# Altium schematic sheet USBc to Ethernet(2.0).SchDoc (part 2 of 3)
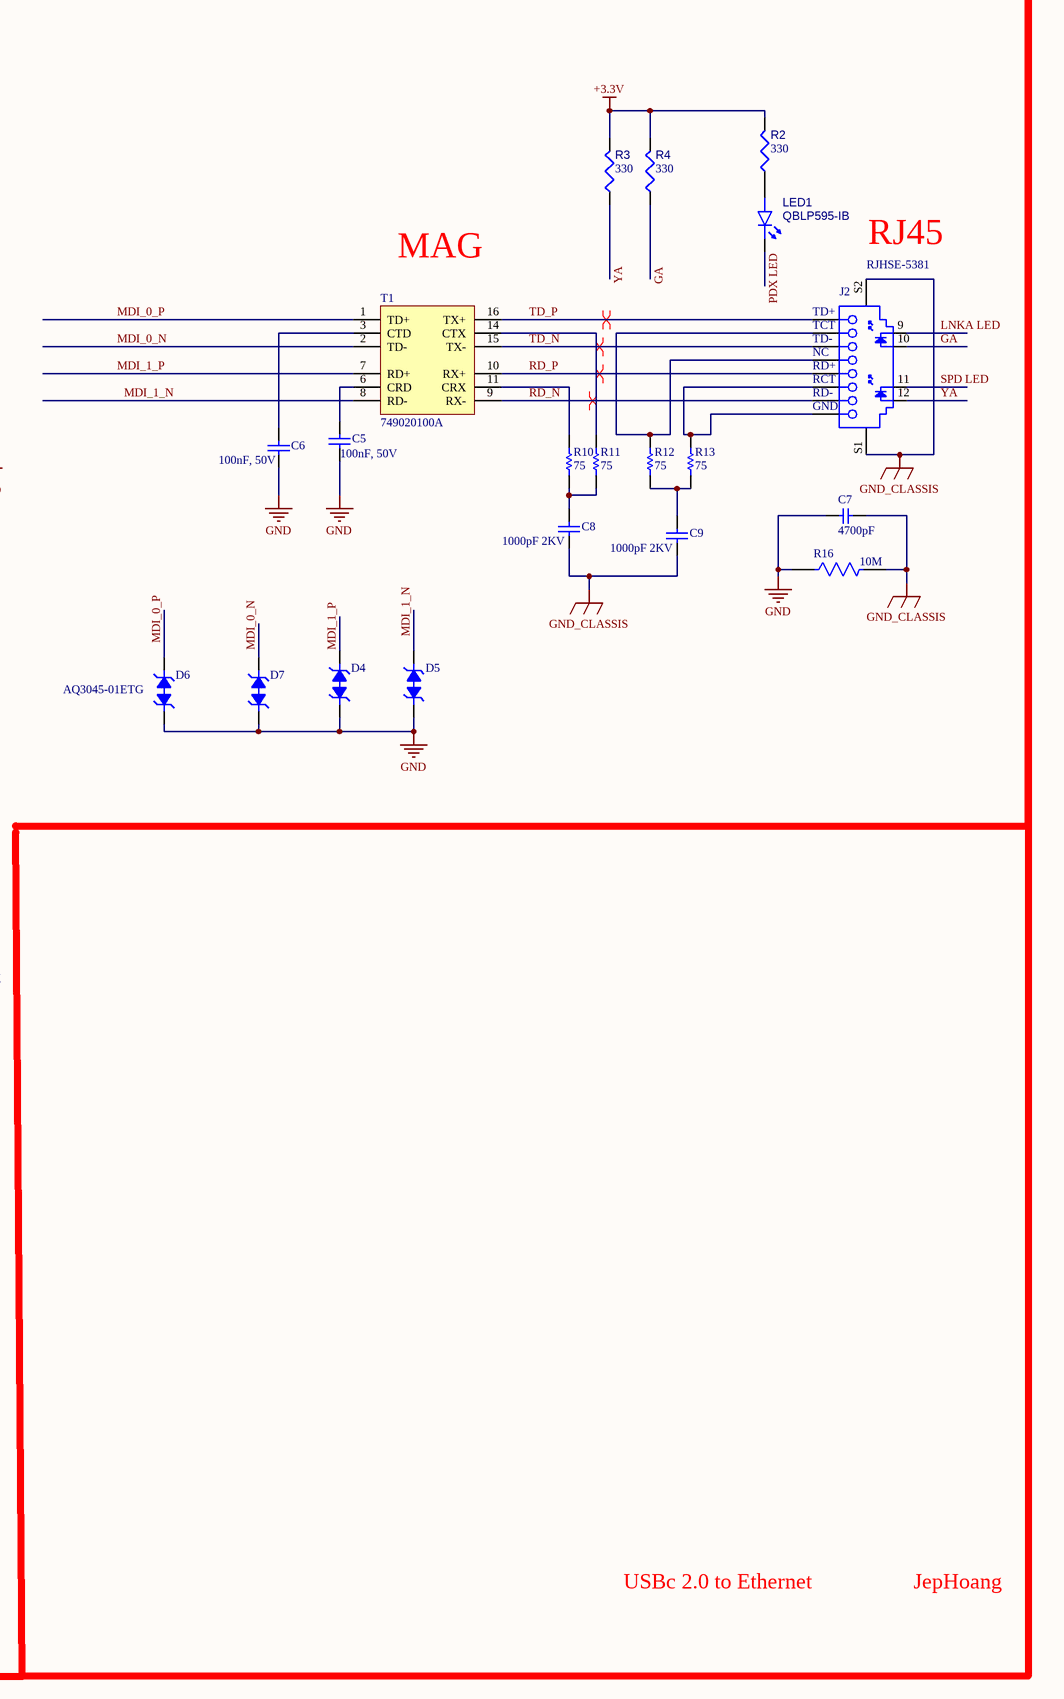
[diagram p2: USBc to Ethernet(2.0).SchDoc, right]
## Library data of the parts
C1 C5 C6 C13-C15 C26 C29 C31 = CL05B104KB54PNC: CAP CER 0.1UF 50V X7R 0402; Manufacturer: Samsung; Dielectric Material: Ceramic; Supplier: Digikey; Supplier Part Number: 1276-CL05B104KB54PNCCT-ND; Manufacturer Part Number: CL05B104KB54PNC; RoHS: Yes; Category: Ceramic Capacitors; Stock: 1237875; Pricing: 1=0.1, 10=0.044, 50=0.025, 100=0.0194, 500=0.0146, 1000=0.01147, 2500=0.01043, 5000=0.00959 (USD); Pins: 2; Capacitor Type: Ceramic; RoHS Compliant: Yes; Reach SVHC Compliant: Yes; ComponentLink1URL: https://datasheet.ciiva.com:443/pdfs/VipMasterIC/IC/SEMS/SEMS-S-A0006318249/SEMS-S-A0006320959-1.pdf?src-supplier=IHS+Markit; ComponentLink1Description: https://datasheet.ciiva.com:443/pdfs/VipMasterIC/IC/SEMS/SEMS-S-A0006318249/SEMS-S-A0006320959-1.pdf?src-supplier=IHS+Markit; ComponentLink2URL: https://datasheet.octopart.com/CL05B104KB54PNC-Samsung-datasheet-8326407.pdf?src-supplier=TME; ComponentLink2Description: https://datasheet.octopart.com/CL05B104KB54PNC-Samsung-datasheet-8326407.pdf?src-supplier=TME; LCSC Part Number: C307331
C2 C3 = CL05C150JC51PNC: Multilayer Ceramic Capacitors MLCC - SMD/SMT 0402 C0G 15pF 5% 100V automotive grade; Manufacturer: Samsung Electro-Mechanics; Temperature Coefficient: 30ppm/°C; Supplier 1: DigiKey; Manufacturer Part Number: CL05C150JC51PNC; RoHS: Compliant; Category: Ceramic Capacitors; Stock 1: 123361; Pricing 1: 1=0.1, 10=0.055, 50=0.0378, 100=0.0326, 500=0.02386 (USD); Capacitance: 15pF; Case/Package: 0402; China RoHS: Compliant; Dielectric Material: Ceramic; Height: 500µm; Length: 1mm; Lifecycle Status: Production; Material: Ceramic; Max Operating Temperature: 125°C; Min Operating Temperature: -55°C; Mount: Surface Mount; Number of Terminals: 2; REACH SVHC: Unaffected; Tolerance: 5%; Voltage Rating: 100V; Voltage Rating (DC): 100V; Width: 500µm; ComponentLink1URL: https://datasheet.octopart.com:443/CL05C150JC51PNC-Samsung-Electro-Mechanics-datasheet-176142735.pdf?src-supplier=IHS; ComponentLink1Description: https://datasheet.octopart.com:443/CL05C150JC51PNC-Samsung-Electro-Mechanics-datasheet-176142735.pdf?src-supplier=IHS
C4 C7 C16 C27 C32 C34 C36 C39 = CL05B472KB5NNNC: 4700 pF ±10% 50V Ceramic Capacitor X7R 0402 (1005 Metric); Manufacturer: Samsung Electro-Mechanics; Capacitance: 4.7nF; Supplier 1: DigiKey; Manufacturer Part Number: CL05B472KB5NNNC; RoHS: Compliant; Category: Ceramic Capacitors; Stock 1: 84266; Pricing 1: 1=0.1, 10=0.033, 50=0.0224, 100=0.019, 500=0.01354 (USD); Case/Package: 0402; Case Code (Imperial): 0402; Case Code (Metric): 1005; China RoHS: Compliant; Country of Origin: Mainland China, Philippines, South Korea; Depth: 500µm; Dielectric: X7R; Dielectric Material: Ceramic; Export Control Classification Number (ECCN) Code: EAR99; Height: 550µm; Harmonized Tariff Schedule (HTS) Code: 8532.24.00.20; Introduction Date: 2010-02-10; Lead Free: Lead Free; Length: 1mm; Lifecycle Status: Production; Material: Ceramic; Max Operating Temperature: 125°C; Min Operating Temperature: -55°C; Mount: Surface Mount; Number of Terminals: 2; Radiation Hardening: No; REACH SVHC: Unaffected; Schedule B: 8532240020, 8532240020|8532240020, 8532240020|8532240020|8532240020, 8532240020|8532240020|8532240020|8532240020; Thickness: 558.8µm; Tolerance: 10%; Voltage: 50V; Voltage Rating: 50V; Voltage Rating (DC): 50V; Width: 500µm; ComponentLink1URL: https://datasheet.octopart.com:443/CL05B472KB5NNNC-Samsung-Electro-Mechanics-datasheet-182018856.pdf?src-supplier=IHS; ComponentLink1Description: https://datasheet.octopart.com:443/CL05B472KB5NNNC-Samsung-Electro-Mechanics-datasheet-182018856.pdf?src-supplier=IHS; ComponentLink2URL: https://datasheet.octopart.com:443/CL05B472KB5NNNC-Samsung-Electro-Mechanics-datasheet-137699841.pdf?src-supplier=Samsung+SCT; ComponentLink2Description: https://datasheet.octopart.com:443/CL05B472KB5NNNC-Samsung-Electro-Mechanics-datasheet-137699841.pdf?src-supplier=Samsung+SCT; ComponentLink3URL: https://datasheet.octopart.com:443/CL05B472KB5NNNC-Samsung-Electro-Mechanics-datasheet-116890943.pdf?src-supplier=Future+Electronics; ComponentLink3Description: https://datasheet.octopart.com:443/CL05B472KB5NNNC-Samsung-Electro-Mechanics-datasheet-116890943.pdf?src-supplier=Future+Electronics; ComponentLink4URL: https://datasheet.octopart.com:443/CL05B472KB5NNNC-Samsung-Electro-Mechanics-datasheet-81461654.pdf?src-supplier=Future+Electronics; ComponentLink4Description: https://datasheet.octopart.com:443/CL05B472KB5NNNC-Samsung-Electro-Mechanics-datasheet-81461654.pdf?src-supplier=Future+Electronics; ComponentLink5URL: https://datasheet.octopart.com:443/CL05B472KB5NNNC-Samsung-datasheet-42485177.pdf?src-supplier=Future+Electronics; ComponentLink5Description: https://datasheet.octopart.com:443/CL05B472KB5NNNC-Samsung-datasheet-42485177.pdf?src-supplier=Future+Electronics; ComponentLink6URL: https://datasheet.octopart.com:443/CL05B472KB5NNNC-Samsung-datasheet-26589051.pdf?src-supplier=Future+Electronics; ComponentLink6Description: https://datasheet.octopart.com:443/CL05B472KB5NNNC-Samsung-datasheet-26589051.pdf?src-supplier=Future+Electronics; ComponentLink7URL: https://datasheet.octopart.com:443/CL05B472KB5NNNC-Samsung-datasheet-12537298.pdf?src-supplier=Future+Electronics; ComponentLink7Description: https://datasheet.octopart.com:443/CL05B472KB5NNNC-Samsung-datasheet-12537298.pdf?src-supplier=Future+Electronics; ComponentLink8URL: https://datasheet.octopart.com:443/CL05B472KB5NNNC-Samsung-Electro-Mechanics-datasheet-149154072.pdf?src-supplier=Future+Electronics; ComponentLink8Description: https://datasheet.octopart.com:443/CL05B472KB5NNNC-Samsung-Electro-Mechanics-datasheet-149154072.pdf?src-supplier=Future+Electronics; ComponentLink9URL: https://datasheet.octopart.com/CL05B472KB5NNNC-Samsung-Electro-Mechanics-datasheet-97040617.pdf; ComponentLink9Description: https://datasheet.octopart.com/CL05B472KB5NNNC-Samsung-Electro-Mechanics-datasheet-97040617.pdf; ComponentLink10URL: https://datasheet.octopart.com/CL05B472KB5NNNC-Samsung-Electro-Mechanics-datasheet-8324245.pdf; ComponentLink10Description: https://datasheet.octopart.com/CL05B472KB5NNNC-Samsung-Electro-Mechanics-datasheet-8324245.pdf; ComponentLink11URL: https://datasheet.octopart.com:443/CL05B472KB5NNNC-Samsung-Electro-Mechanics-datasheet-11772878.pdf?src-supplier=Arrow+Electronics; ComponentLink11Description: https://datasheet.octopart.com:443/CL05B472KB5NNNC-Samsung-Electro-Mechanics-datasheet-11772878.pdf?src-supplier=Arrow+Electronics; ComponentLink12URL: https://datasheet.octopart.com:443/CL05B472KB5NNNC-Samsung-datasheet-8326407.pdf?src-supplier=TME; ComponentLink12Description: https://datasheet.octopart.com:443/CL05B472KB5NNNC-Samsung-datasheet-8326407.pdf?src-supplier=TME
C8 C9 = CMP-2000-05161-1: Chip Capacitor, 1 nF, +/- 10%, 2000 V, -55 to 125 degC, 1206 (3216 Metric), RoHS, Tape and Reel; Manufacturer: Johanson Dielectrics; Brand: JohansonDielectrics; Case Length: 3.15mm; Type: HighVoltageCapacitors; Dielectric: X7R; Case Width: 1.6mm; Class: 2; Case Height: 1.27mm; Case Code - mm: 3216; Package / Case: 1206(3216metric); Case Code - in: 1206; Voltage Rating DC: 2kV; Manufacturer URL: http://www.johansondielectrics.com; Tolerance: 10%; Minimum Operating Temperature: -55C; Termination Style: SMD/SMT; Datasheet Version: Apr-07; RoHS: Details; Factory Pack Quantity: 3000; Datasheet URL: http://www.farnell.com/datasheets/87135.pdf; Capacitance: 1000pF; Product Category: MultilayerCeramicCapacitorsMLCC-SMD/SMT; Maximum Operating Temperature: +125C; Product: GeneralTypeMLCCs; Packaging: Reel
C10 C11 = CL05A106MP5NUNC: CAP CER 10UF 10V X5R 0402; Manufacturer: Samsung Electro-Mechanics; Capacitance: 10µF; Dielectric Material: Ceramic; Tolerance: 20%; Supplier 1: DigiKey; Manufacturer Part Number: CL05A106MP5NUNC; RoHS: Compliant; Category: Ceramic Capacitors; Stock 1: 4; Pricing 1: 1=0.18, 10=0.104, 50=0.0732, 100=0.0638, 500=0.0481 (USD); Case/Package: 0402; Case Code (Imperial): 0402; Case Code (Metric): 1005; China RoHS: Compliant; Contact Plating: Tin; Depth: 500µm; Dielectric: X5R; Height: 700µm; Lead Free: Lead Free; Length: 1mm; Lifecycle Status: NRND; Material: Ceramic; Max Operating Temperature: 85°C; Min Operating Temperature: -55°C; Mount: Surface Mount; Number of Terminals: 2; Packaging: Tape and Reel; Radiation Hardening: No; REACH SVHC: Unaffected; Schedule B: 8532240020, 8532240020|8532240020|8532240020|8532240020|8532240020|8532240020|8532240020|8532240020|8532240020|8532240020|8532240020|8532240020|8532240020|8532240020|8532240020|8532240020|8532240020|8532240020|8532240020|8532240020|8532240020|8532240020|8532240020|85; Termination: Wraparound; Thickness: 711.2µm; Voltage Rating: 10V; Voltage Rating (DC): 10V; Width: 500µm; ComponentLink1URL: https://datasheet.octopart.com:443/CL05A106MP5NUNC-Samsung-Electro-Mechanics-datasheet-182018593.pdf?src-supplier=IHS; ComponentLink1Description: https://datasheet.octopart.com:443/CL05A106MP5NUNC-Samsung-Electro-Mechanics-datasheet-182018593.pdf?src-supplier=IHS; ComponentLink2URL: https://datasheet.octopart.com:443/CL05A106MP5NUNC-Samsung-Electro-Mechanics-datasheet-136031723.pdf?src-supplier=Upverter; ComponentLink2Description: https://datasheet.octopart.com:443/CL05A106MP5NUNC-Samsung-Electro-Mechanics-datasheet-136031723.pdf?src-supplier=Upverter; ComponentLink3URL: https://datasheet.octopart.com:443/CL05A106MP5NUNC-Samsung-Electro-Mechanics-datasheet-110226206.pdf?src-supplier=Future+Electronics; ComponentLink3Description: https://datasheet.octopart.com:443/CL05A106MP5NUNC-Samsung-Electro-Mechanics-datasheet-110226206.pdf?src-supplier=Future+Electronics; ComponentLink4URL: https://datasheet.octopart.com:443/CL05A106MP5NUNC-Samsung-Electro-Mechanics-datasheet-87580039.pdf?src-supplier=Future+Electronics; ComponentLink4Description: https://datasheet.octopart.com:443/CL05A106MP5NUNC-Samsung-Electro-Mechanics-datasheet-87580039.pdf?src-supplier=Future+Electronics; ComponentLink5URL: https://datasheet.octopart.com:443/CL05A106MP5NUNC-Samsung-Electro-Mechanics-datasheet-81461595.pdf?src-supplier=Future+Electronics; ComponentLink5Description: https://datasheet.octopart.com:443/CL05A106MP5NUNC-Samsung-Electro-Mechanics-datasheet-81461595.pdf?src-supplier=Future+Electronics; ComponentLink6URL: https://datasheet.octopart.com:443/CL05A106MP5NUNC-Samsung-datasheet-42280527.pdf?src-supplier=Future+Electronics; ComponentLink6Description: https://datasheet.octopart.com:443/CL05A106MP5NUNC-Samsung-datasheet-42280527.pdf?src-supplier=Future+Electronics; ComponentLink7URL: https://datasheet.octopart.com:443/CL05A106MP5NUNC-Samsung-datasheet-34153002.pdf?src-supplier=Future+Electronics; ComponentLink7Description: https://datasheet.octopart.com:443/CL05A106MP5NUNC-Samsung-datasheet-34153002.pdf?src-supplier=Future+Electronics; ComponentLink8URL: https://datasheet.octopart.com:443/CL05A106MP5NUNC-Samsung-datasheet-25077983.pdf?src-supplier=Future+Electronics; ComponentLink8Description: https://datasheet.octopart.com:443/CL05A106MP5NUNC-Samsung-datasheet-25077983.pdf?src-supplier=Future+Electronics; ComponentLink9URL: https://datasheet.octopart.com:443/CL05A106MP5NUNC-Samsung-Electro-Mechanics-datasheet-149136670.pdf?src-supplier=Future+Electronics; ComponentLink9Description: https://datasheet.octopart.com:443/CL05A106MP5NUNC-Samsung-Electro-Mechanics-datasheet-149136670.pdf?src-supplier=Future+Electronics; ComponentLink10URL: https://datasheet.octopart.com:443/CL05A106MP5NUNC-Samsung-datasheet-8326407.pdf?src-supplier=TME; ComponentLink10Description: https://datasheet.octopart.com:443/CL05A106MP5NUNC-Samsung-datasheet-8326407.pdf?src-supplier=TME
C12 = CL05A475MO5NUNC: CAP CER 4.7UF 16V X5R 0402; Manufacturer: Samsung Electro-Mechanics; Capacitance: 4.7µF; Dielectric Material: Ceramic; Tolerance: 20%; Supplier 1: DigiKey; Manufacturer Part Number: CL05A475MO5NUNC; RoHS: Compliant; Category: Ceramic Capacitors; Stock 1: 764058; Pricing 1: 1=0.52, 10=0.316, 50=0.2358, 100=0.211, 500=0.16936 (USD); Case/Package: 0402; Case Code (Imperial): 0402; Case Code (Metric): 1005; China RoHS: Compliant; Dielectric: X5R; Height: 500µm; Length: 1mm; Lifecycle Status: Production; Material: Ceramic; Max Operating Temperature: 85°C; Min Operating Temperature: -55°C; Mount: Surface Mount; Number of Terminals: 2; REACH SVHC: Unaffected; Schedule B: 8532240020, 8532240020|8532240020, 8532240020|8532240020|8532240020, 8532240020|8532240020|8532240020|8532240020; Thickness: 558.8µm; Voltage Rating: 16V; Voltage Rating (DC): 16V; Width: 500µm; ComponentLink1URL: https://datasheet.octopart.com:443/CL05A475MO5NUNC-Samsung-Electro-Mechanics-datasheet-178175196.pdf?src-supplier=Farnell; ComponentLink1Description: https://datasheet.octopart.com:443/CL05A475MO5NUNC-Samsung-Electro-Mechanics-datasheet-178175196.pdf?src-supplier=Farnell; ComponentLink2URL: https://datasheet.octopart.com:443/CL05A475MO5NUNC-Samsung-Electro-Mechanics-datasheet-123102911.pdf?src-supplier=Future+Electronics; ComponentLink2Description: https://datasheet.octopart.com:443/CL05A475MO5NUNC-Samsung-Electro-Mechanics-datasheet-123102911.pdf?src-supplier=Future+Electronics; ComponentLink3URL: https://datasheet.octopart.com:443/CL05A475MO5NUNC-Samsung-Electro-Mechanics-datasheet-110226225.pdf?src-supplier=Future+Electronics; ComponentLink3Description: https://datasheet.octopart.com:443/CL05A475MO5NUNC-Samsung-Electro-Mechanics-datasheet-110226225.pdf?src-supplier=Future+Electronics; ComponentLink4URL: https://datasheet.octopart.com:443/CL05A475MO5NUNC-Samsung-Electro-Mechanics-datasheet-83567908.pdf?src-supplier=Future+Electronics; ComponentLink4Description: https://datasheet.octopart.com:443/CL05A475MO5NUNC-Samsung-Electro-Mechanics-datasheet-83567908.pdf?src-supplier=Future+Electronics; ComponentLink5URL: https://datasheet.octopart.com:443/CL05A475MO5NUNC-Samsung-Electro-Mechanics-datasheet-68297032.pdf?src-supplier=Future+Electronics; ComponentLink5Description: https://datasheet.octopart.com:443/CL05A475MO5NUNC-Samsung-Electro-Mechanics-datasheet-68297032.pdf?src-supplier=Future+Electronics; ComponentLink6URL: https://datasheet.octopart.com:443/CL05A475MO5NUNC-Samsung-Electro-Mechanics-datasheet-87580057.pdf?src-supplier=Future+Electronics; ComponentLink6Description: https://datasheet.octopart.com:443/CL05A475MO5NUNC-Samsung-Electro-Mechanics-datasheet-87580057.pdf?src-supplier=Future+Electronics; ComponentLink7URL: https://datasheet.octopart.com:443/CL05A475MO5NUNC-Samsung-Electro-Mechanics-datasheet-149136694.pdf?src-supplier=Future+Electronics; ComponentLink7Description: https://datasheet.octopart.com:443/CL05A475MO5NUNC-Samsung-Electro-Mechanics-datasheet-149136694.pdf?src-supplier=Future+Electronics
C17 C28 C33 = CL05B152KB5VPNC: 1500 pF ±10% 50V Ceramic Capacitor X7R 0402 (1005 Metric); Manufacturer: Samsung Electro-Mechanics; Capacitance: 1.5nF; Supplier 1: DigiKey; Manufacturer Part Number: CL05B152KB5VPNC; RoHS: Compliant; Category: Ceramic Capacitors; Stock 1: 275794; Pricing 1: 1=0.1, 10=0.036, 50=0.0242, 100=0.0206, 500=0.01472 (USD); Case/Package: 0402; Case Code (Imperial): 0402; Case Code (Metric): 1005; China RoHS: Compliant; Dielectric Material: Ceramic; Features: Soft Termination; Height: 550µm; Lead Free: Lead Free; Length: 990.6µm; Lifecycle Status: Production; Material: Ceramic; Max Operating Temperature: 125°C; Min Operating Temperature: -55°C; Mount: Surface Mount; Number of Terminals: 2; Packaging: Tape & Reel (TR); Ratings: AEC-Q200; REACH SVHC: Unaffected; Thickness: 558.8µm; Tolerance: 10%; Voltage Rating: 50V; Voltage Rating (DC): 50V; Width: 508µm; ComponentLink1URL: https://datasheet.octopart.com:443/CL05B152KB5VPNC-Samsung-Electro-Mechanics-datasheet-176142735.pdf?src-supplier=IHS; ComponentLink1Description: https://datasheet.octopart.com:443/CL05B152KB5VPNC-Samsung-Electro-Mechanics-datasheet-176142735.pdf?src-supplier=IHS; ComponentLink2URL: https://datasheet.octopart.com:443/CL05B152KB5VPNC-Samsung-Electro-Mechanics-datasheet-141346877.pdf?src-supplier=Samsung+SCT; ComponentLink2Description: https://datasheet.octopart.com:443/CL05B152KB5VPNC-Samsung-Electro-Mechanics-datasheet-141346877.pdf?src-supplier=Samsung+SCT; ComponentLink3URL: https://datasheet.octopart.com:443/CL05B152KB5VPNC-Samsung-datasheet-66660282.pdf?src-supplier=Future+Electronics; ComponentLink3Description: https://datasheet.octopart.com:443/CL05B152KB5VPNC-Samsung-datasheet-66660282.pdf?src-supplier=Future+Electronics; ComponentLink4URL: https://datasheet.octopart.com:443/CL05B152KB5VPNC-Samsung-datasheet-62043905.pdf?src-supplier=Future+Electronics; ComponentLink4Description: https://datasheet.octopart.com:443/CL05B152KB5VPNC-Samsung-datasheet-62043905.pdf?src-supplier=Future+Electronics; ComponentLink5URL: https://datasheet.octopart.com:443/CL05B152KB5VPNC-Samsung-Electro-Mechanics-datasheet-68304628.pdf?src-supplier=Future+Electronics; ComponentLink5Description: https://datasheet.octopart.com:443/CL05B152KB5VPNC-Samsung-Electro-Mechanics-datasheet-68304628.pdf?src-supplier=Future+Electronics; ComponentLink6URL: https://datasheet.octopart.com:443/CL05B152KB5VPNC-Samsung-Electro-Mechanics-datasheet-149136721.pdf?src-supplier=Future+Electronics; ComponentLink6Description: https://datasheet.octopart.com:443/CL05B152KB5VPNC-Samsung-Electro-Mechanics-datasheet-149136721.pdf?src-supplier=Future+Electronics; ComponentLink7URL: https://datasheet.octopart.com:443/CL05B152KB5VPNC-Samsung-datasheet-8326407.pdf?src-supplier=TME; ComponentLink7Description: https://datasheet.octopart.com:443/CL05B152KB5VPNC-Samsung-datasheet-8326407.pdf?src-supplier=TME
C18 C19 C22 C24 C35 = CL05B104KB5NNNC: Multilayer Ceramic Capacitors MLCC - SMD/SMT 100nF0.150V X7R 1005 0402; Manufacturer: Samsung Electro-Mechanics; Tolerance: 10%; Supplier 1: DigiKey; Manufacturer Part Number: CL05B104KB5NNNC; RoHS: Compliant; Category: Ceramic Capacitors; Stock 1: 1658214; Pricing 1: 1=0.11, 10=0.056, 50=0.0386, 100=0.0332, 500=0.0242 (USD); Capacitance: 100nF; Case/Package: 0402; China RoHS: Compliant; Country of Origin: Mainland China, Philippines, South Korea; Dielectric: X7R; Dielectric Material: Ceramic; Export Control Classification Number (ECCN) Code: EAR99; Height: 550µm; Harmonized Tariff Schedule (HTS) Code: 8532.24.00.20; Introduction Date: 2017-07-04; Lifecycle Status: Production; Material: Ceramic; Max Operating Temperature: 125°C; Min Operating Temperature: -55°C; Mount: Surface Mount; Number of Terminals: 2; REACH SVHC: Unaffected; Voltage Rating: 50V; Voltage Rating (DC): 50V; ComponentLink1URL: https://datasheet.octopart.com:443/CL05B104KB5NNNC-Samsung-Electro-Mechanics-datasheet-141346860.pdf?src-supplier=IHS; ComponentLink1Description: https://datasheet.octopart.com:443/CL05B104KB5NNNC-Samsung-Electro-Mechanics-datasheet-141346860.pdf?src-supplier=IHS; ComponentLink2URL: https://datasheet.octopart.com/CL05B104KB5NNNC-Samsung-Electro-Mechanics-datasheet-97040617.pdf; ComponentLink2Description: https://datasheet.octopart.com/CL05B104KB5NNNC-Samsung-Electro-Mechanics-datasheet-97040617.pdf; ComponentLink3URL: https://datasheet.octopart.com/General-Multilayer-Ceramic-Capacitors-Samsung-datasheet-family-111.pdf; ComponentLink3Description: https://datasheet.octopart.com/General-Multilayer-Ceramic-Capacitors-Samsung-datasheet-family-111.pdf; ComponentLink4URL: https://datasheet.octopart.com:443/CL05B104KB5NNNC-Samsung-datasheet-8326407.pdf?src-supplier=TME; ComponentLink4Description: https://datasheet.octopart.com:443/CL05B104KB5NNNC-Samsung-datasheet-8326407.pdf?src-supplier=TME; ComponentLink5URL: http://sigma.octopart.com:80/rohs_certificate/General-Multilayer-Ceramic-Capacitors-Samsung-family-110.pdf?src-supplier=Compliance+Statements; ComponentLink5Description: http://sigma.octopart.com:80/rohs_certificate/General-Multilayer-Ceramic-Capacitors-Samsung-family-110.pdf?src-supplier=Compliance+Statements; ComponentLink6URL: http://sigma.octopart.com:80/rohs_statement/General-Multilayer-Ceramic-Capacitors-Samsung-family-132.pdf?src-supplier=Compliance+Statements; ComponentLink6Description: http://sigma.octopart.com:80/rohs_statement/General-Multilayer-Ceramic-Capacitors-Samsung-family-132.pdf?src-supplier=Compliance+Statements; ComponentLink7URL: http://sigma.octopart.com:80/reach_statement/General-Multilayer-Ceramic-Capacitors-Samsung-family-133.pdf?src-supplier=Compliance+Statements; ComponentLink7Description: http://sigma.octopart.com:80/reach_statement/General-Multilayer-Ceramic-Capacitors-Samsung-family-133.pdf?src-supplier=Compliance+Statements; Mouser Part Number: 187-CL05B104KB5NNNC
C20 C21 C23 C25 = CMP-001-00069-3: Chip Capacitor, 10nF +/-20%, 50V, 0402, Thickness 0.6 mm; Tolerance: 5%; Max Operating Temperature: 85°C; Pins: 2; Case/Package: 0402; Voltage Rating: 50V; Min Operating Temperature: -55°C; Mounting Technology: SMT
C30 = CMP-001-00063-3: Chip Capacitor, 1µF +/-20%, 10V, 0402, Thickness 0.6 mm; Tolerance: 10%; Mounting Technology: SMT; Max Operating Temperature: 85°C; Voltage Rating: 10V; Pins: 2; Case/Package: 0402; Min Operating Temperature: -55°C
C37 C38 = CMP-001-00072-4: Chip Capacitor, 12pF +/-10%, 50V, 0402, Thickness 0.33 mm; Tolerance: 20%; Pins: 2; Max Operating Temperature: 85°C; Case/Package: 0402; Voltage Rating: 50V; Mounting Technology: SMT; Min Operating Temperature: -55°C
D1-D7 = AQ3045-01ETG: TVS DIODE 5.3VWM 12VC SOD882; Manufacturer: Littelfuse; Diode Element Material: SILICON; Package Body Material: Plastic; Polarity: Bidirectional; Max Breakdown Voltage: 9V; Min Breakdown Voltage: 6.8V; Diode Type: TRANS VOLTAGE SUPPRESSOR; Non-rep Peak Rev Power Dis-Max: 40W; Number of Elements: 1; Rep Pk Reverse Voltage-Max: 5.3V; Reference Standard: AEC-Q101; Supplier: Digikey; Supplier Part Number: F9321CT-ND; Manufacturer Part Number: AQ3045-01ETG; RoHS: Yes; Category: TVS Diodes; Stock: 21664; Pricing: 1=0.5, 10=0.391, 100=0.2344, 500=0.217, 1000=0.14756, 2000=0.13585, 5000=0.1302 (USD); Pins: 2; Package Shape: Rectangular; Min Operating Temperature: -55°C; Max Operating Temperature: 150°C; Package Style: CHIP CARRIERMeter; Surface Mount: Yes; Technology: AVALANCHE; Terminal Form: No Lead; Terminal Position: BOTTOM; Reach SVHC Compliant: Yes; RoHS Compliant: Yes; ComponentLink1URL: https://datasheet.ciiva.com:443/pdfs/VipMasterIC/IC/LFSI/LFSI-S-A0007892042/LFSI-S-A0007892042-1.pdf?src-supplier=IHS+Markit; ComponentLink1Description: https://datasheet.ciiva.com:443/pdfs/VipMasterIC/IC/LFSI/LFSI-S-A0007892042/LFSI-S-A0007892042-1.pdf?src-supplier=IHS+Markit; ComponentLink2URL: https://www.littelfuse.com/~/media/electronics/datasheets/tvs_diode_arrays/littelfuse_tvs_diode_array_aq3045_datasheet.pdf.pdf?src-supplier=Digikey; ComponentLink2Description: https://www.littelfuse.com/~/media/electronics/datasheets/tvs_diode_arrays/littelfuse_tvs_diode_array_aq3045_datasheet.pdf.pdf?src-supplier=Digikey; ComponentLink3URL: http://www.littelfuse.com/~/media/electronics/datasheets/tvs_diode_arrays/littelfuse_tvs_diode_array_aq3045_datasheet.pdf.pdf?src-supplier=Digikey; ComponentLink3Description: http://www.littelfuse.com/~/media/electronics/datasheets/tvs_diode_arrays/littelfuse_tvs_diode_array_aq3045_datasheet.pdf.pdf?src-supplier=Digikey; LCSC Part Number: C3710326
FB1-FB3 = MMZ1608B121CTAH0: FERRITE BEAD 120 OHM 0603 1LN; Manufacturer: TDK; Manufacturer Lifecycle Status: PRODUCTION; Current Rating: 600mA; DC Resistance (DCR): 150mΩ; Impedance: 120Ω; Number of Circuits: 1; Test Frequency: 100MHz; Tolerance: 25%; Supplier 1: DigiKey; Manufacturer Part Number: MMZ1608B121CTAH0; RoHS: Compliant; Category: Ferrite Beads and Chips; Stock 1: 284237; Pricing 1: 1=0.1, 10=0.053, 25=0.046, 50=0.0414, 100=0.0372, 250=0.03208, 500=0.02858, 1000=0.02535 (USD); Case/Package: 0603; Case Code (Imperial): 0603; Case Code (Metric): 1608; Core Material: Ferrite; Depth: 800µm; Export Control Classification Number (ECCN) Code: EAR99; Height: 600µm; Harmonized Tariff Schedule (HTS) Code: 8504.50.80.00; Introduction Date: 2009-03-27; Length: 1.6mm; Lifecycle Status: Production; Max DC Current: 600mA; Max Length: 1.75mm; Max Operating Temperature: 125°C; Max Width: 950µm; Min Length: 1.45mm; Min Operating Temperature: -55°C; Min Width: 650µm; Mount: Surface Mount; Number of Terminals: 2; REACH SVHC: Unaffected; Resistance: 150mΩ; RMS Current (Irms): 600mA; Schedule B: 8504500000, 8504500000|8504500000|8504500000|8504500000|8504500000; Series Resistance: 150mΩ; Width: 800µm; ComponentLink1URL: https://datasheet.octopart.com:443/MMZ1608B121CTAH0-TDK-datasheet-151651381.pdf?src-supplier=ODG+(Origin+Data+Global); ComponentLink1Description: https://datasheet.octopart.com:443/MMZ1608B121CTAH0-TDK-datasheet-151651381.pdf?src-supplier=ODG+(Origin+Data+Global); ComponentLink2URL: https://datasheet.octopart.com:443/MMZ1608B121CTAH0-TDK-datasheet-41213274.pdf?src-supplier=Upverter; ComponentLink2Description: https://datasheet.octopart.com:443/MMZ1608B121CTAH0-TDK-datasheet-41213274.pdf?src-supplier=Upverter; ComponentLink3URL: https://datasheet.octopart.com:443/MMZ1608B121CTAH0-TDK-datasheet-82475256.pdf?src-supplier=Newark; ComponentLink3Description: https://datasheet.octopart.com:443/MMZ1608B121CTAH0-TDK-datasheet-82475256.pdf?src-supplier=Newark; ComponentLink4URL: https://datasheet.octopart.com:443/MMZ1608B121CTAH0-TDK-datasheet-101614771.pdf?src-supplier=Newark; ComponentLink4Description: https://datasheet.octopart.com:443/MMZ1608B121CTAH0-TDK-datasheet-101614771.pdf?src-supplier=Newark; ComponentLink5URL: https://datasheet.octopart.com:443/MMZ1608B121CTAH0-TDK-datasheet-17595614.pdf?src-supplier=TME; ComponentLink5Description: https://datasheet.octopart.com:443/MMZ1608B121CTAH0-TDK-datasheet-17595614.pdf?src-supplier=TME
J1 = 217179-0001: USB-C (USB TYPE-C) USB 2.0 Receptacle Connector 24 (16+8 Dummy) Position Surface Mount, Right Angle; Through Hole; Manufacturer: Molex; Manufacturer Lifecycle Status: ACTIVE; Contact Resistance: 50mΩ; Current Rating: 1.25A; Dielectric Material: Polyamide; Gender: Female; Insulation Resistance: 100MΩ; Number of Contacts: 16; Number of Ports: 1; USB Standard: USB 2.0; Voltage Rating: 30V; Supplier 1: DigiKey; Manufacturer Part Number: 217179-0001; RoHS: Compliant; Category: USB Connectors; Stock 1: 93695; Pricing 1: 1=0.9, 10=0.764, 25=0.7156, 50=0.6814, 100=0.6487, 250=0.60808, 500=0.57902 (USD); China RoHS: Compliant; Contact Material: Gold, Nickel; Country of Origin: Mainland China; Export Control Classification Number (ECCN) Code: EAR99; Height: 3.36mm; Harmonized Tariff Schedule (HTS) Code: 8536.69.40.30; Insulation Color: Black; Introduction Date: 2021-08-30; Lifecycle Status: Production; Max Operating Temperature: 85°C; Min Operating Temperature: -40°C; Number of Positions: 16; Number of Rows: 1; Orientation: Right Angle; REACH SVHC: Unaffected; Shell Finish: Nickel; Shell Material: Stainless Steel; Terminal Pitch: 500µm; ComponentLink1URL: https://datasheet.octopart.com:443/217179-0001-Molex-datasheet-158871109.pdf?src-supplier=ODG+(Origin+Data+Global); ComponentLink1Description: https://datasheet.octopart.com:443/217179-0001-Molex-datasheet-158871109.pdf?src-supplier=ODG+(Origin+Data+Global); ComponentLink2URL: https://sigma.octopart.com:443/158871110/technical_drawing/Molex-217179-0001.pdf?src-supplier=Upverter; ComponentLink2Description: https://sigma.octopart.com:443/158871110/technical_drawing/Molex-217179-0001.pdf?src-supplier=Upverter; ComponentLink3URL: https://datasheet.octopart.com:443/217179-0001-Molex-datasheet-164573281.pdf?src-supplier=RS+(Formerly+Allied+Electronics); ComponentLink3Description: https://datasheet.octopart.com:443/217179-0001-Molex-datasheet-164573281.pdf?src-supplier=RS+(Formerly+Allied+Electronics); ComponentLink4URL: http://sigma.octopart.com:80/reach_statement/Molex-company-74.pdf?src-supplier=Compliance+Statements; ComponentLink4Description: http://sigma.octopart.com:80/reach_statement/Molex-company-74.pdf?src-supplier=Compliance+Statements; ComponentLink5URL: http://sigma.octopart.com:80/rohs_statement/Molex-company-73.pdf?src-supplier=Compliance+Statements; ComponentLink5Description: http://sigma.octopart.com:80/rohs_statement/Molex-company-73.pdf?src-supplier=Compliance+Statements; ComponentLink6URL: http://sigma.octopart.com:80/conflict_mineral_statement/Molex-company-72.pdf?src-supplier=Compliance+Statements; ComponentLink6Description: http://sigma.octopart.com:80/conflict_mineral_statement/Molex-company-72.pdf?src-supplier=Compliance+Statements
J2 = CMP-2000-06980-1: High Speed RJ45, Modular Jack, 8 Position, 8 Contacts, Shielded, with LEDs, -55 to 85 degC,12-Pin THD, RoHS, Tray; Manufacturer: Amphenol; Number of Positions/Contacts: 8p8c(RJ45,Ethernet); Number of Ports: 1; Catalog Drawings: RJ45SeriesRightAngle; PCN Design/Specification: MultipleSeriesCopper29/Jan/2009RJHSEShieldMaterial30/Jun/2015; Other Names: RJHSE5381; Online Catalog: RJHSESeries; Featured Product: ModularJacksProductSolutions; Tab Direction: Up; Shielding: Shielded,EMIFinger; LED Color: Yellow-Green; 3D Model: RJHSE538x.stpRJHSE538x.igs; Category: Connectors,Interconnects; Termination: Solder; Housing Material: Thermoplastic; Mounting Type: ThroughHole; Family: ModularConnectors-Jacks; Orientation: 90°Angle(Right); Features: BoardLock; Contact Material: PhosphorBronze; Mounting Technology: ThroughHole; Number of Rows: 1; Standard Package: 120; Ratings: -; Operating Temperature: -55°C~85°C; Series: RJHSE; Contact Finish: Gold; Package Reference: RJHSE-5381; Ingress Protection: -; Package Description: 12-Pin Through Hole Device, Body 16.51 x 15.75 mm; Contact Finish Thickness: 50µin(1.27µm); Datasheet URL: https://datasheet.ciiva.com/16481/rjhse538x-16481714.pdf; Datasheet Version: Rev. K, 04/2014; Connector Type: Jack; Manufacturer URL: http://www.amphenol.com/; Packaging: Tray
LED1 = CMP-007-00042-3: Chip LED 0402, Blue, 0.02 A, 3.1 to 3.7 V, -40 to 80 degC, 2-Pin SMD, RoHS, Tape and Reel; RoHS Compliant: Yes; Colour: Blue; Pins: 2; Case/Package: 0402; Mounting Technology: SMT
R1 R5 = AF0402FR-075K1L: 5.1 kOhms ±1% 0.063W, 1/16W Chip Resistor 0402 (1005 Metric) Anti-Sulfur, Automotive AEC-Q200 Thick Film; Manufacturer: Yageo Group; Max Power Dissipation: 63mW; Power Rating: 62.5mW; Resistance: 5.1kΩ; Temperature Coefficient: 100ppm/°C; Voltage Rating: 50V; Supplier 1: DigiKey; Manufacturer Part Number: AF0402FR-075K1L; RoHS: Compliant; Category: Chip SMD Resistors; Stock 1: 1902; Pricing 1: 1=0.1, 10=0.041, 25=0.0312, 50=0.0256, 100=0.0212, 250=0.01684, 500=0.01436, 1000=0.01241, 5000=0.00931 (USD); Case/Package: 0402; China RoHS: Non-Compliant; Composition: Thick Film; Features: Anti-Sulfur, Moisture Resistant; Height: 350µm; Lead Free: Lead Free; Length: 1mm; Lifecycle Status: Production; Max Operating Temperature: 155°C; Min Operating Temperature: -55°C; Mount: Surface Mount; Number of Terminals: 2; Number of Terminations: 2; Ratings: AEC-Q200; REACH SVHC: Unaffected; Tolerance: 1%; Width: 500µm; Working Voltage: 50V; ComponentLink1URL: https://datasheet.octopart.com:443/AF0402FR-075K1L-Yageo-datasheet-182189395.pdf?src-supplier=IHS; ComponentLink1Description: https://datasheet.octopart.com:443/AF0402FR-075K1L-Yageo-datasheet-182189395.pdf?src-supplier=IHS; ComponentLink2URL: https://datasheet.octopart.com:443/AF0402FR-075K1L-Yageo-datasheet-153645569.pdf?src-supplier=Upverter; ComponentLink2Description: https://datasheet.octopart.com:443/AF0402FR-075K1L-Yageo-datasheet-153645569.pdf?src-supplier=Upverter; ComponentLink3URL: https://sigma.octopart.com:443/138820526/technical_drawing/Yageo-AF0402FR-075K1L.pdf?src-supplier=Upverter; ComponentLink3Description: https://sigma.octopart.com:443/138820526/technical_drawing/Yageo-AF0402FR-075K1L.pdf?src-supplier=Upverter; ComponentLink4URL: https://datasheet.octopart.com:443/AF0402FR-075K1L-Yageo-Group-datasheet-183876366.pdf?src-supplier=LCSC; ComponentLink4Description: https://datasheet.octopart.com:443/AF0402FR-075K1L-Yageo-Group-datasheet-183876366.pdf?src-supplier=LCSC; ComponentLink5URL: https://datasheet.octopart.com:443/AF0402FR-075K1L-Yageo-datasheet-164730775.pdf?src-supplier=Future+Electronics; ComponentLink5Description: https://datasheet.octopart.com:443/AF0402FR-075K1L-Yageo-datasheet-164730775.pdf?src-supplier=Future+Electronics; ComponentLink6URL: https://datasheet.octopart.com:443/AF0402FR-075K1L-Yageo-datasheet-137481464.pdf?src-supplier=Future+Electronics; ComponentLink6Description: https://datasheet.octopart.com:443/AF0402FR-075K1L-Yageo-datasheet-137481464.pdf?src-supplier=Future+Electronics; ComponentLink7URL: https://datasheet.octopart.com:443/AF0402FR-075K1L-Yageo-datasheet-65873192.pdf?src-supplier=Future+Electronics; ComponentLink7Description: https://datasheet.octopart.com:443/AF0402FR-075K1L-Yageo-datasheet-65873192.pdf?src-supplier=Future+Electronics; ComponentLink8URL: https://datasheet.octopart.com:443/AF0402FR-075K1L-Yageo-datasheet-39119213.pdf?src-supplier=Future+Electronics; ComponentLink8Description: https://datasheet.octopart.com:443/AF0402FR-075K1L-Yageo-datasheet-39119213.pdf?src-supplier=Future+Electronics; ComponentLink9URL: https://datasheet.octopart.com:443/AF0402FR-075K1L-Yageo-datasheet-34148693.pdf?src-supplier=Future+Electronics; ComponentLink9Description: https://datasheet.octopart.com:443/AF0402FR-075K1L-Yageo-datasheet-34148693.pdf?src-supplier=Future+Electronics; ComponentLink10URL: https://datasheet.octopart.com:443/AF0402FR-075K1L-Yageo-datasheet-27714391.pdf?src-supplier=Future+Electronics; ComponentLink10Description: https://datasheet.octopart.com:443/AF0402FR-075K1L-Yageo-datasheet-27714391.pdf?src-supplier=Future+Electronics; ComponentLink11URL: https://datasheet.octopart.com:443/AF0402FR-075K1L-Yageo-datasheet-20945081.pdf?src-supplier=Future+Electronics; ComponentLink11Description: https://datasheet.octopart.com:443/AF0402FR-075K1L-Yageo-datasheet-20945081.pdf?src-supplier=Future+Electronics; ComponentLink12URL: https://datasheet.octopart.com/AF0402FR-075K1L-Yageo-datasheet-68296209.pdf; ComponentLink12Description: https://datasheet.octopart.com/AF0402FR-075K1L-Yageo-datasheet-68296209.pdf; ComponentLink13URL: http://sigma.octopart.com:80/conflict_mineral_statement/Yageo-company-3.pdf?src-supplier=Compliance+Statements; ComponentLink13Description: http://sigma.octopart.com:80/conflict_mineral_statement/Yageo-company-3.pdf?src-supplier=Compliance+Statements; ComponentLink14URL: http://sigma.octopart.com:80/rohs_statement/Yageo-company-2.pdf?src-supplier=Compliance+Statements; ComponentLink14Description: http://sigma.octopart.com:80/rohs_statement/Yageo-company-2.pdf?src-supplier=Compliance+Statements
R2-R4 = CMP-009-00132-3: Chip Resistor, 330 Ohms, +/-5 %, 63 mW, -55 to 155 degC, 0402; Power: 63mW; Tolerance: 5%; Pins: 2; Max Operating Temperature: 155°C; Min Operating Temperature: -55°C; Case/Package: 0402
R6 = RC0402JR-070RL: RES 0 OHM JUMPER 1/16W 0402; Manufacturer: Yageo; Power: 62.5mW; Rated Temperature: 70°C; Package Height: 0.35mm; Package Length: 1mm; Package Width: 0.5mm; Supplier: Digikey; Supplier Part Number: 311-0.0JRCT-ND; Manufacturer Part Number: RC0402JR-070RL; RoHS: Yes; Category: Chip SMD Resistors; Stock: 5988729; Pricing: 1=0.1, 10=0.011, 25=0.0084, 50=0.0064, 100=0.0045, 250=0.00364, 500=0.0029, 1000=0.00214, 5000=0.00154 (USD); Mounting Technology: Surface Mount; Pins: 2; Package Shape: Rectangular; Case/Package: 0402; Terminal Finish: Nickel; Min Operating Temperature: -55°C; Max Operating Temperature: 155°C; JESD-609 Code: e3; Resistor Type: FIXED RESISTOR; Construction: Chip; Package Style: SMTMeter; Packaging: Tape and Reel; Value: 0R; Technology: METAL GLAZE/THICK FILM; Termination: Wraparound; Reach SVHC Compliant: Yes; RoHS Compliant: Yes; ComponentLink1URL: https://datasheet.ciiva.com:443/pdfs/VipMasterIC/IC/YAGO/YAGO-S-A0008145938/YAGO-S-A0008145938-1.pdf?src-supplier=IHS+Markit; ComponentLink1Description: https://datasheet.ciiva.com:443/pdfs/VipMasterIC/IC/YAGO/YAGO-S-A0008145938/YAGO-S-A0008145938-1.pdf?src-supplier=IHS+Markit; LCSC Part Number: C60485
R7 = RT0402FRE07500RL: 500 Ohms 1% 0.063W, 1/16W Chip Resistor 0402 (1005 Metric) Moisture Resistant; Manufacturer: Yageo Group; Power Rating: 63mW; Resistance: 500Ω; Temperature Coefficient: 50ppm/°C; Voltage Rating: 50V; Supplier 1: DigiKey; Manufacturer Part Number: RT0402FRE07500RL; RoHS: Compliant; Category: Chip SMD Resistors; Pricing 1: 1=0.1, 10=0.014, 50=0.0126, 100=0.0119, 500=0.01044 (USD); Case/Package: 0402; Composition: Thin Film; Height: 350µm; Max Operating Temperature: 155°C; Min Operating Temperature: -55°C; Packaging: Tape & Reel; Tolerance: 1%; ComponentLink1URL: https://datasheet.octopart.com:443/RT0402FRE07500RL-Yageo-datasheet-176402239.pdf?src-supplier=element14+APAC; ComponentLink1Description: https://datasheet.octopart.com:443/RT0402FRE07500RL-Yageo-datasheet-176402239.pdf?src-supplier=element14+APAC; ComponentLink2URL: https://sigma.octopart.com:443/138820526/technical_drawing/Yageo-RT0402FRE07500RL.pdf?src-supplier=Upverter; ComponentLink2Description: https://sigma.octopart.com:443/138820526/technical_drawing/Yageo-RT0402FRE07500RL.pdf?src-supplier=Upverter; ComponentLink3URL: https://datasheet.octopart.com:443/RT0402FRE07500RL-Yageo-Group-datasheet-188167888.pdf?src-supplier=LCSC; ComponentLink3Description: https://datasheet.octopart.com:443/RT0402FRE07500RL-Yageo-Group-datasheet-188167888.pdf?src-supplier=LCSC; ComponentLink4URL: https://datasheet.octopart.com/RT0402FRE07500RL-Yageo-datasheet-86813807.pdf; ComponentLink4Description: https://datasheet.octopart.com/RT0402FRE07500RL-Yageo-datasheet-86813807.pdf; ComponentLink5URL: http://sigma.octopart.com:80/conflict_mineral_statement/Yageo-company-3.pdf?src-supplier=Compliance+Statements; ComponentLink5Description: http://sigma.octopart.com:80/conflict_mineral_statement/Yageo-company-3.pdf?src-supplier=Compliance+Statements; ComponentLink6URL: http://sigma.octopart.com:80/rohs_statement/Yageo-company-2.pdf?src-supplier=Compliance+Statements; ComponentLink6Description: http://sigma.octopart.com:80/rohs_statement/Yageo-company-2.pdf?src-supplier=Compliance+Statements
R8 R9 = CMP-009-00071-2: 12K 0.063W 1% 0402 (1005 Metric)  SMD; Power: 63mW; Tolerance: 1%; Case/Package: 0402; Mounting Technology: SMT; Pins: 2
R10-R13 = CMP-2002-07798-1: Manufacturer: Yageo / Phycomp; Part Number: RC0402FR-0775RL
R14 R18-R22 R24-R26 = AC0402FR-0710KL: RES SMD 10K OHM 1% 1/16W 0402; Manufacturer: Yageo Group; Max Power Dissipation: 63mW; Power Rating: 62.5mW; Resistance: 10kΩ; Temperature Coefficient: 100ppm/°C; Voltage Rating: 50V; Supplier 1: DigiKey; Manufacturer Part Number: AC0402FR-0710KL; RoHS: Compliant; Category: Chip SMD Resistors; Stock 1: 3191206; Pricing 1: 1=0.1, 10=0.024, 25=0.0176, 50=0.014, 100=0.0114, 250=0.00876, 500=0.00726, 1000=0.00612, 5000=0.00431 (USD); Case/Package: 0402; Case Code (Imperial): 0402; Case Code (Metric): 1005; China RoHS: Non-Compliant; Composition: Thick Film; Country of Origin: Mainland China, Taiwan; Depth: 500µm; Export Control Classification Number (ECCN) Code: EAR99; Features: Automotive AEC-Q200, Moisture Resistant; Height: 320µm; Harmonized Tariff Schedule (HTS) Code: 8533.21.00.30; Introduction Date: 2012-04-10; Lead Free: Lead Free; Length: 1mm; Lifecycle Status: Production; Max Operating Temperature: 155°C; Military Standard: Not; Min Operating Temperature: -55°C; Mount: Surface Mount; Number of Terminals: 2; Number of Terminations: 2; Packaging: Tape & Reel; Ratings: AEC-Q200; REACH SVHC: Unaffected; Schedule B: 8533210045, 8533210045|8533210045|8533210045|8533210045|8533210045|8533210045|8533210045|8533210045|8533210045|8533210045|8533210045|8533210045|8533210045|8533210045|8533210045|8533210045|8533210045|8533210045|8533210045, 8533210045|8533210045|8533210045|8533210045|8533210045|8533210045|8533210045|8533210045|8533210045|8533210045|8533210045|8533210045|8533210045|8533210045|8533210045|8533210045|8533210045|8533210045|8533210045|8533210045|8533210045|8533210045|8533210045|85; Termination: SMD/SMT; Tolerance: 1%; Width: 500µm; Working Voltage: 50V; ComponentLink1URL: https://datasheet.octopart.com:443/AC0402FR-0710KL-Yageo-datasheet-182189377.pdf?src-supplier=IHS; ComponentLink1Description: https://datasheet.octopart.com:443/AC0402FR-0710KL-Yageo-datasheet-182189377.pdf?src-supplier=IHS; ComponentLink2URL: https://datasheet.octopart.com:443/AC0402FR-0710KL-Yageo-datasheet-83209224.pdf?src-supplier=Upverter; ComponentLink2Description: https://datasheet.octopart.com:443/AC0402FR-0710KL-Yageo-datasheet-83209224.pdf?src-supplier=Upverter; ComponentLink3URL: https://datasheet.octopart.com:443/AC0402FR-0710KL-Yageo-datasheet-178509465.pdf?src-supplier=Newark; ComponentLink3Description: https://datasheet.octopart.com:443/AC0402FR-0710KL-Yageo-datasheet-178509465.pdf?src-supplier=Newark; ComponentLink4URL: https://datasheet.octopart.com:443/AC0402FR-0710KL-Yageo-datasheet-166720450.pdf?src-supplier=JRH+Electronics; ComponentLink4Description: https://datasheet.octopart.com:443/AC0402FR-0710KL-Yageo-datasheet-166720450.pdf?src-supplier=JRH+Electronics; ComponentLink5URL: https://datasheet.octopart.com:443/AC0402FR-0710KL-Yageo-datasheet-151884373.pdf?src-supplier=Future+Electronics; ComponentLink5Description: https://datasheet.octopart.com:443/AC0402FR-0710KL-Yageo-datasheet-151884373.pdf?src-supplier=Future+Electronics; ComponentLink6URL: https://datasheet.octopart.com:443/AC0402FR-0710KL-Yageo-Group-datasheet-189830439.pdf?src-supplier=Future+Electronics; ComponentLink6Description: https://datasheet.octopart.com:443/AC0402FR-0710KL-Yageo-Group-datasheet-189830439.pdf?src-supplier=Future+Electronics; ComponentLink7URL: https://datasheet.octopart.com:443/AC0402FR-0710KL-Yageo-datasheet-137699919.pdf?src-supplier=Future+Electronics; ComponentLink7Description: https://datasheet.octopart.com:443/AC0402FR-0710KL-Yageo-datasheet-137699919.pdf?src-supplier=Future+Electronics; ComponentLink8URL: https://datasheet.octopart.com:443/AC0402FR-0710KL-Yageo-datasheet-24580492.pdf?src-supplier=Future+Electronics; ComponentLink8Description: https://datasheet.octopart.com:443/AC0402FR-0710KL-Yageo-datasheet-24580492.pdf?src-supplier=Future+Electronics; ComponentLink9URL: https://datasheet.octopart.com:443/AC0402FR-0710KL-Yageo-datasheet-13029202.pdf?src-supplier=Future+Electronics; ComponentLink9Description: https://datasheet.octopart.com:443/AC0402FR-0710KL-Yageo-datasheet-13029202.pdf?src-supplier=Future+Electronics; ComponentLink10URL: https://datasheet.octopart.com/AC0402FR-0710KL-Yageo-datasheet-12512238.pdf; ComponentLink10Description: https://datasheet.octopart.com/AC0402FR-0710KL-Yageo-datasheet-12512238.pdf; ComponentLink11URL: https://datasheet.octopart.com:443/AC0402FR-0710KL-Yageo-Group-datasheet-164768995.pdf?src-supplier=ODG+(Origin+Data+Global); ComponentLink11Description: https://datasheet.octopart.com:443/AC0402FR-0710KL-Yageo-Group-datasheet-164768995.pdf?src-supplier=ODG+(Origin+Data+Global); ComponentLink12URL: https://datasheet.octopart.com:443/AC0402FR-0710KL-Yageo-datasheet-128677448.pdf?src-supplier=X-ON; ComponentLink12Description: https://datasheet.octopart.com:443/AC0402FR-0710KL-Yageo-datasheet-128677448.pdf?src-supplier=X-ON; ComponentLink13URL: http://sigma.octopart.com:80/conflict_mineral_statement/Yageo-company-3.pdf?src-supplier=Compliance+Statements; ComponentLink13Description: http://sigma.octopart.com:80/conflict_mineral_statement/Yageo-company-3.pdf?src-supplier=Compliance+Statements; ComponentLink14URL: http://sigma.octopart.com:80/rohs_statement/Yageo-company-2.pdf?src-supplier=Compliance+Statements; ComponentLink14Description: http://sigma.octopart.com:80/rohs_statement/Yageo-company-2.pdf?src-supplier=Compliance+Statements
R15 = AC0603FR-0710ML: Res Thick Film 0603 10M Ohm 1% 0.1W(1/10W) ±100ppm/C Pad SMD T/R Automotive AEC-Q200; Manufacturer: Yageo Group; Max Power Dissipation: 100mW; Resistance: 10MΩ; Temperature Coefficient: 100ppm/°C; Voltage Rating: 75V; Supplier 1: DigiKey; Manufacturer Part Number: AC0603FR-0710ML; RoHS: Compliant; Category: Chip SMD Resistors; Stock 1: 74416; Pricing 1: 1=0.1, 10=0.028, 25=0.0204, 50=0.0164, 100=0.0134, 250=0.01036, 500=0.00868, 1000=0.00735 (USD); Case/Package: 0603; Case Code (Imperial): 0603; Case Code (Metric): 1608; China RoHS: Non-Compliant; Composition: Thick Film; Country of Origin: Mainland China, Taiwan; Export Control Classification Number (ECCN) Code: EAR99; Features: Automotive AEC-Q200, Moisture Resistant; Height: 450µm; Harmonized Tariff Schedule (HTS) Code: 8533.21.00.30; Introduction Date: 2012-04-10; Length: 1.6mm; Lifecycle Status: Production; Max Operating Temperature: 155°C; Min Operating Temperature: -55°C; Mount: Surface Mount; Number of Terminals: 2; Number of Terminations: 2; Packaging: Tape & Reel; Power Rating: 100mW; Ratings: AEC-Q200; REACH SVHC: Unaffected; Schedule B: 8533210045, 8533210045|8533210045|8533210045|8533210045|8533210045|8533210045|8533210045|8533210045|8533210045|8533210045|8533210045|8533210045|8533210045, 8533210045|8533210045|8533210045|8533210045|8533210045|8533210045|8533210045|8533210045|8533210045|8533210045|8533210045|8533210045|8533210045|8533210045, 8533210045|8533210045|8533210045|8533210045|8533210045|8533210045|8533210045|8533210045|8533210045|8533210045|8533210045|8533210045|8533210045|8533210045|8533210045; Termination: SMD/SMT; Tolerance: 1%; Weight: 2.012816mg; Width: 800µm; Working Voltage: 75V; ComponentLink1URL: https://datasheet.octopart.com:443/AC0603FR-0710ML-Yageo-datasheet-182189377.pdf?src-supplier=IHS; ComponentLink1Description: https://datasheet.octopart.com:443/AC0603FR-0710ML-Yageo-datasheet-182189377.pdf?src-supplier=IHS; ComponentLink2URL: https://datasheet.octopart.com:443/AC0603FR-0710ML-Yageo-datasheet-86786639.pdf?src-supplier=Upverter; ComponentLink2Description: https://datasheet.octopart.com:443/AC0603FR-0710ML-Yageo-datasheet-86786639.pdf?src-supplier=Upverter; ComponentLink3URL: https://datasheet.octopart.com:443/AC0603FR-0710ML-Yageo-datasheet-178509465.pdf?src-supplier=Newark; ComponentLink3Description: https://datasheet.octopart.com:443/AC0603FR-0710ML-Yageo-datasheet-178509465.pdf?src-supplier=Newark; ComponentLink4URL: https://datasheet.octopart.com:443/AC0603FR-0710ML-Yageo-Group-datasheet-188689268.pdf?src-supplier=LCSC; ComponentLink4Description: https://datasheet.octopart.com:443/AC0603FR-0710ML-Yageo-Group-datasheet-188689268.pdf?src-supplier=LCSC; ComponentLink5URL: https://datasheet.octopart.com:443/AC0603FR-0710ML-Yageo-datasheet-166720450.pdf?src-supplier=Future+Electronics; ComponentLink5Description: https://datasheet.octopart.com:443/AC0603FR-0710ML-Yageo-datasheet-166720450.pdf?src-supplier=Future+Electronics; ComponentLink6URL: https://datasheet.octopart.com:443/AC0603FR-0710ML-Yageo-datasheet-151884373.pdf?src-supplier=Future+Electronics; ComponentLink6Description: https://datasheet.octopart.com:443/AC0603FR-0710ML-Yageo-datasheet-151884373.pdf?src-supplier=Future+Electronics; ComponentLink7URL: https://datasheet.octopart.com:443/AC0603FR-0710ML-Yageo-datasheet-137699919.pdf?src-supplier=Future+Electronics; ComponentLink7Description: https://datasheet.octopart.com:443/AC0603FR-0710ML-Yageo-datasheet-137699919.pdf?src-supplier=Future+Electronics; ComponentLink8URL: https://datasheet.octopart.com:443/AC0603FR-0710ML-Yageo-datasheet-128678881.pdf?src-supplier=X-ON; ComponentLink8Description: https://datasheet.octopart.com:443/AC0603FR-0710ML-Yageo-datasheet-128678881.pdf?src-supplier=X-ON; ComponentLink9URL: https://datasheet.octopart.com/AC0603FR-0710ML-Yageo-datasheet-12512238.pdf; ComponentLink9Description: https://datasheet.octopart.com/AC0603FR-0710ML-Yageo-datasheet-12512238.pdf; ComponentLink10URL: http://sigma.octopart.com:80/conflict_mineral_statement/Yageo-company-3.pdf?src-supplier=Compliance+Statements; ComponentLink10Description: http://sigma.octopart.com:80/conflict_mineral_statement/Yageo-company-3.pdf?src-supplier=Compliance+Statements; ComponentLink11URL: http://sigma.octopart.com:80/rohs_statement/Yageo-company-2.pdf?src-supplier=Compliance+Statements; ComponentLink11Description: http://sigma.octopart.com:80/rohs_statement/Yageo-company-2.pdf?src-supplier=Compliance+Statements
R16 = CMP-2000-03843-2: RES Thick Film, 10MΩ, 1%, 0.1W, 100ppm/°C, 0603; Voltage Rating: 75V; Power Rating: 100mW; Resistance: 10MR; Packaging: Tape and Reel; Depth: 0.85mm; Package Quantity: 5000; Case/Package: 0603; Tolerance: 1%; Case Code (Imperial): 0603; Weight: 7.1E-05oz; Radiation Hardening: No; Composition: Thick Film; Contact Plating: Tin; Max Operating Temperature: 155°C; Military Standard: Not; Case Code (Metric): 1608; Min Operating Temperature: -55°C; Number of Terminations: 2; Mount: Surface Mount; Height: 0.45mm; Lead Free: Lead Free; Voltage Rating (DC): 75V; Width: 0.85mm; Length: 1.55mm; Working Voltage: 75V; Temperature Coefficient: 100ppm/°C; Termination: SMD/SMT